# Altium schematic sheet Copy of KNX_Relay_16CH_V0.2.SchDoc
size 297 x 209 mm
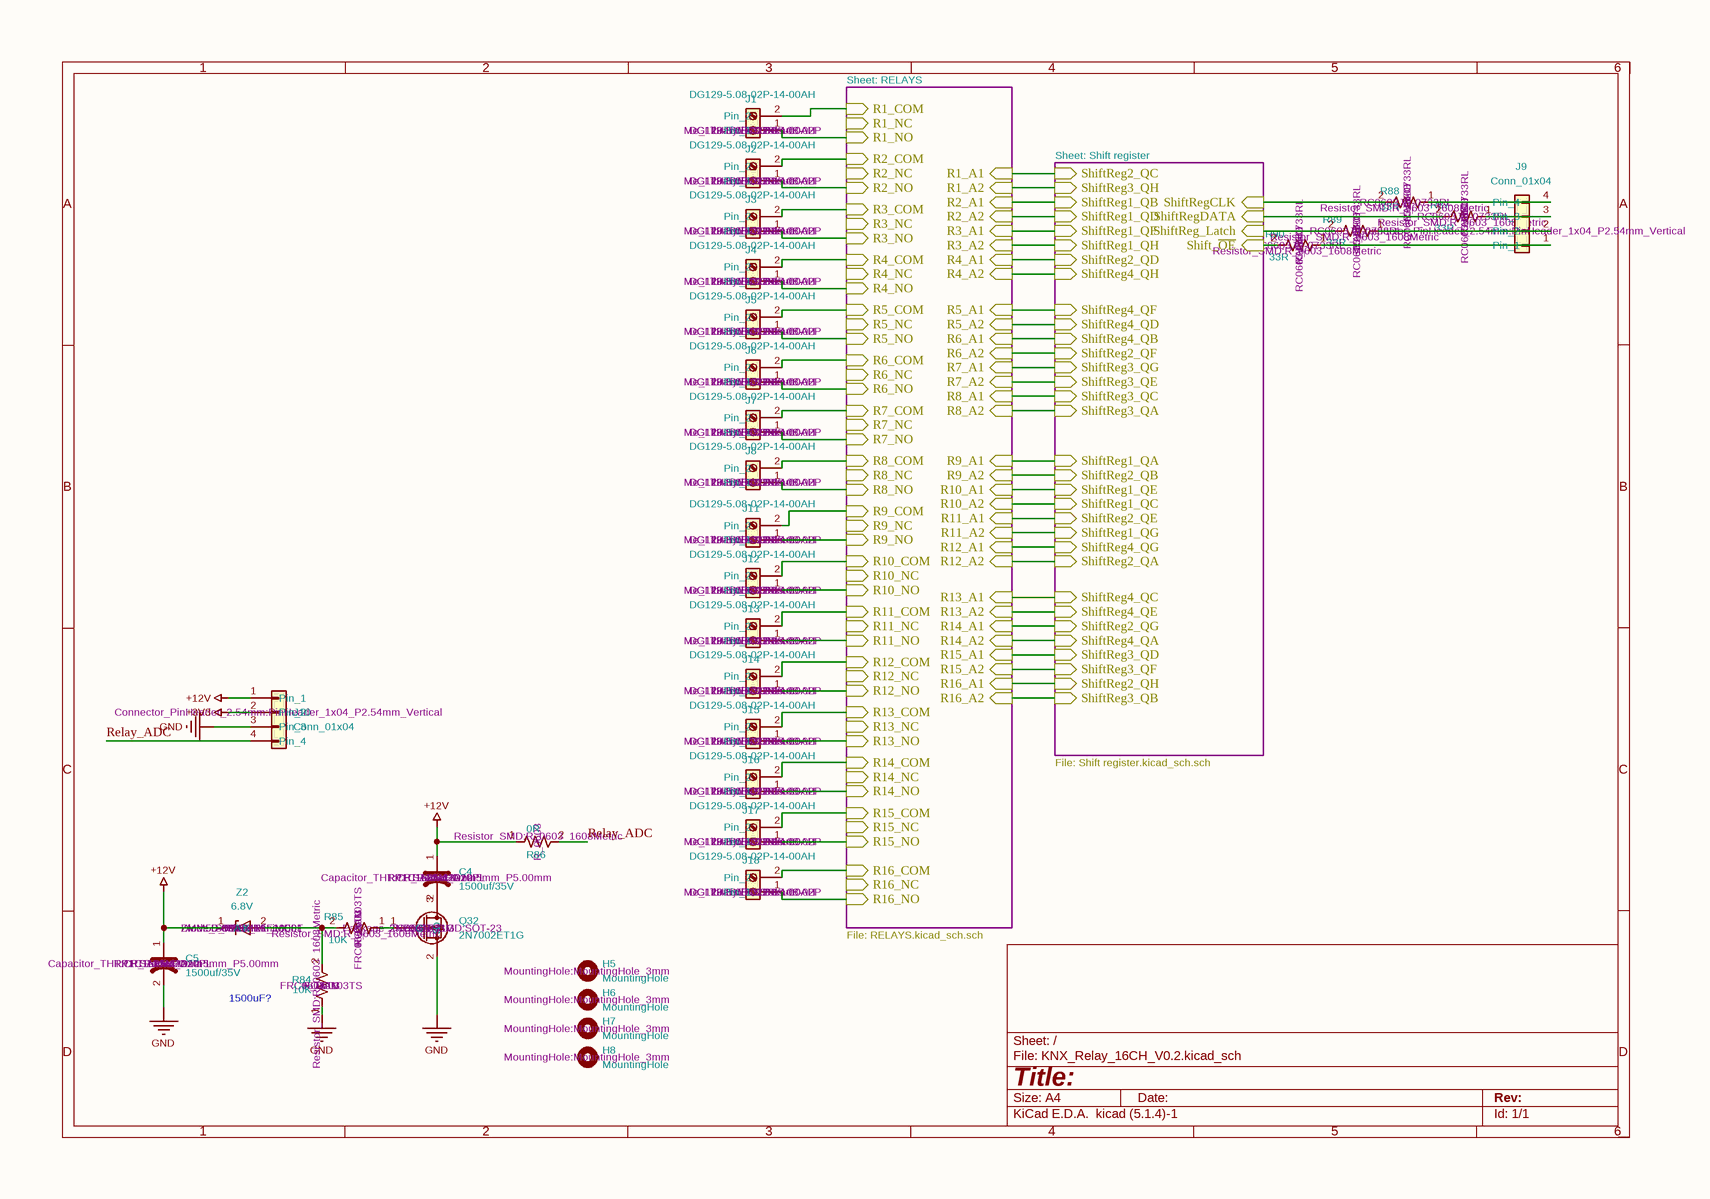
[diagram p0: Copy of KNX_Relay_16CH_V0.2.SchDoc]

## Parts
C4  MP: RP1C158M12020PL  MF: SAMWHA  Package: THT 12.5x20mm  Footprint: Capacitor_THT:CP_Radial_D12.5mm_P5.00mm  [CP_Radial_D12.5mm_P5.00mm]  (hidden comment: 1500uf/35V)
C5  MP: RP1C158M12020PL  MF: SAMWHA  Package: THT 12.5x20mm  Footprint: Capacitor_THT:CP_Radial_D12.5mm_P5.00mm  [CP_Radial_D12.5mm_P5.00mm]  (hidden comment: 1500uf/35V)
H5  Footprint: MountingHole:MountingHole_3mm  [MountingHole_3mm]  (hidden comment: MountingHole)
H6  Footprint: MountingHole:MountingHole_3mm  [MountingHole_3mm]  (hidden comment: MountingHole)
H7  Footprint: MountingHole:MountingHole_3mm  [MountingHole_3mm]  (hidden comment: MountingHole)
H8  Footprint: MountingHole:MountingHole_3mm  [MountingHole_3mm]  (hidden comment: MountingHole)
J1  MF: DEGSON  Package: THT V/T  5.08mm  Footprint: Me_Library:DG129-5.08-02P  [DG129-5.08-02P]  (hidden comment: DG129-5.08-02P-14-00AH)
J2  MF: DEGSON  Package: THT V/T  5.08mm  Footprint: Me_Library:DG129-5.08-02P  [DG129-5.08-02P]  (hidden comment: DG129-5.08-02P-14-00AH)
J3  MF: DEGSON  Package: THT V/T  5.08mm  Footprint: Me_Library:DG129-5.08-02P  [DG129-5.08-02P]  (hidden comment: DG129-5.08-02P-14-00AH)
J4  MF: DEGSON  Package: THT V/T  5.08mm  Footprint: Me_Library:DG129-5.08-02P  [DG129-5.08-02P]  (hidden comment: DG129-5.08-02P-14-00AH)
J5  MF: DEGSON  Package: THT V/T  5.08mm  Footprint: Me_Library:DG129-5.08-02P  [DG129-5.08-02P]  (hidden comment: DG129-5.08-02P-14-00AH)
J6  MF: DEGSON  Package: THT V/T  5.08mm  Footprint: Me_Library:DG129-5.08-02P  [DG129-5.08-02P]  (hidden comment: DG129-5.08-02P-14-00AH)
J7  MF: DEGSON  Package: THT V/T  5.08mm  Footprint: Me_Library:DG129-5.08-02P  [DG129-5.08-02P]  (hidden comment: DG129-5.08-02P-14-00AH)
J8  MF: DEGSON  Package: THT V/T  5.08mm  Footprint: Me_Library:DG129-5.08-02P  [DG129-5.08-02P]  (hidden comment: DG129-5.08-02P-14-00AH)
J9  Footprint: Connector_PinHeader_2.54mm:PinHeader_1x04_P2.54mm_Vertical  [PinHeader_1x04_P2.54mm_Vertical]  (hidden comment: Conn_01x04)
J10  Footprint: Connector_PinHeader_2.54mm:PinHeader_1x04_P2.54mm_Vertical  [PinHeader_1x04_P2.54mm_Vertical]  (hidden comment: Conn_01x04)
J11  MF: DEGSON  Package: THT V/T  5.08mm  Footprint: Me_Library:DG129-5.08-02P  [DG129-5.08-02P]  (hidden comment: DG129-5.08-02P-14-00AH)
J12  MF: DEGSON  Package: THT V/T  5.08mm  Footprint: Me_Library:DG129-5.08-02P  [DG129-5.08-02P]  (hidden comment: DG129-5.08-02P-14-00AH)
J13  MF: DEGSON  Package: THT V/T  5.08mm  Footprint: Me_Library:DG129-5.08-02P  [DG129-5.08-02P]  (hidden comment: DG129-5.08-02P-14-00AH)
J14  MF: DEGSON  Package: THT V/T  5.08mm  Footprint: Me_Library:DG129-5.08-02P  [DG129-5.08-02P]  (hidden comment: DG129-5.08-02P-14-00AH)
J15  MF: DEGSON  Package: THT V/T  5.08mm  Footprint: Me_Library:DG129-5.08-02P  [DG129-5.08-02P]  (hidden comment: DG129-5.08-02P-14-00AH)
J16  MF: DEGSON  Package: THT V/T  5.08mm  Footprint: Me_Library:DG129-5.08-02P  [DG129-5.08-02P]  (hidden comment: DG129-5.08-02P-14-00AH)
J17  MF: DEGSON  Package: THT V/T  5.08mm  Footprint: Me_Library:DG129-5.08-02P  [DG129-5.08-02P]  (hidden comment: DG129-5.08-02P-14-00AH)
J18  MF: DEGSON  Package: THT V/T  5.08mm  Footprint: Me_Library:DG129-5.08-02P  [DG129-5.08-02P]  (hidden comment: DG129-5.08-02P-14-00AH)
Q32  MF: onsemi  Footprint: Package_TO_SOT_SMD:SOT-23  [SOT-23]  (hidden comment: 2N7002ET1G)
R84  MP: FRC0603J103TS  MF: FOJAN  Package: R_0603  Footprint: Resistor_SMD:R_0603_1608Metric  [R_0603_1608Metric]  (hidden comment: 10K)
R85  MP: FRC0603J103TS  MF: FOJAN  Package: R_0603  Footprint: Resistor_SMD:R_0603_1608Metric  [R_0603_1608Metric]  (hidden comment: 10K)
R86  Package: R_0603  Footprint: Resistor_SMD:R_0603_1608Metric  [R_0603_1608Metric]  (hidden comment: 0R)
R87  MP: RC0603JR-0733RL  MF: YAGEO  Package: R_0603  Footprint: Resistor_SMD:R_0603_1608Metric  [R_0603_1608Metric]  (hidden comment: 33R)
R88  MP: RC0603JR-0733RL  MF: YAGEO  Package: R_0603  Footprint: Resistor_SMD:R_0603_1608Metric  [R_0603_1608Metric]  (hidden comment: 33R)
R89  MP: RC0603JR-0733RL  MF: YAGEO  Package: R_0603  Footprint: Resistor_SMD:R_0603_1608Metric  [R_0603_1608Metric]  (hidden comment: 33R)
R90  MP: RC0603JR-0733RL  MF: YAGEO  Package: R_0603  Footprint: Resistor_SMD:R_0603_1608Metric  [R_0603_1608Metric]  (hidden comment: 33R)
Z2  MF: PANJIT  MP: ZMM55-C6V8_R1_10001  Footprint: Diode_SMD:D_MiniMELF  [D_MiniMELF]  (hidden comment: 6.8V)

## Sub-sheets
RELAYS = RELAYS.SchDoc: R1_A1 (in), R1_A2 (in), R1_COM (in), R1_NC (in), R1_NO (in), R2_A1 (in), R2_A2 (in), R2_COM (in), R2_NC (in), R2_NO (in), R3_A1 (in), R3_A2 (in), R3_COM (in), R3_NC (in), R3_NO (in), R4_A1 (in), R4_A2 (in), R4_COM (in), R4_NC (in), R4_NO (in), R5_A1 (in), R5_A2 (in), R5_COM (in), R5_NC (in), R5_NO (in), R6_A1 (in), R6_A2 (in), R6_COM (in), R6_NC (in), R6_NO (in), R7_A1 (in), R7_A2 (in), R7_COM (in), R7_NC (in), R7_NO (in), R8_A1 (in), R8_A2 (in), R8_COM (in), R8_NC (in), R8_NO (in), R9_A1 (in), R9_A2 (in), R9_COM (in), R9_NC (in), R9_NO (in), R10_A1 (in), R10_A2 (in), R10_COM (in), R10_NC (in), R10_NO (in), R11_A1 (in), R11_A2 (in), R11_COM (in), R11_NC (in), R11_NO (in), R12_A1 (in), R12_A2 (in), R12_COM (in), R12_NC (in), R12_NO (in), R13_A1 (in), R13_A2 (in), R13_COM (in), R13_NC (in), R13_NO (in), R14_A1 (in), R14_A2 (in), R14_COM (in), R14_NC (in), R14_NO (in), R15_A1 (in), R15_A2 (in), R15_COM (in), R15_NC (in), R15_NO (in), R16_A1 (in), R16_A2 (in), R16_COM (in), R16_NC (in), R16_NO (in)
Shift register = Shift register.SchDoc: ShiftReg1_QA (in), ShiftReg1_QB (in), ShiftReg1_QC (in), ShiftReg1_QD (in), ShiftReg1_QE (in), ShiftReg1_QF (in), ShiftReg1_QG (in), ShiftReg1_QH (in), ShiftReg2_QA (in), ShiftReg2_QB (in), ShiftReg2_QC (in), ShiftReg2_QD (in), ShiftReg2_QE (in), ShiftReg2_QF (in), ShiftReg2_QG (in), ShiftReg2_QH (in), ShiftRegCLK (in), ShiftRegDATA (in), ShiftReg_Latch (in), Shift_~{OE} (in), ShiftReg3_QA (in), ShiftReg3_QB (in), ShiftReg3_QC (in), ShiftReg3_QD (in), ShiftReg3_QE (in), ShiftReg3_QF (in), ShiftReg3_QG (in), ShiftReg3_QH (in), ShiftReg4_QA (in), ShiftReg4_QB (in), ShiftReg4_QC (in), ShiftReg4_QD (in), ShiftReg4_QE (in), ShiftReg4_QF (in), ShiftReg4_QG (in), ShiftReg4_QH (in)

## Nets
+3V3: J10.2(Pin_2)
+12V: C4.1 C5.1 J10.1(Pin_1) R86.1 Z2.1(K)
GND: C5.2 J10.3(Pin_3) Q32.2(S) R84.1
Relay_ADC: J10.4(Pin_4) R86.2
NetC4_2: C4.2 Q32.3(D)
NetJ1_1: J1.1(Pin_1) ; sheet RELAYS/R1_NO
NetJ1_2: J1.2(Pin_2) ; sheet RELAYS/R1_COM
NetJ2_1: J2.1(Pin_1) ; sheet RELAYS/R2_NO
NetJ2_2: J2.2(Pin_2) ; sheet RELAYS/R2_COM
NetJ3_1: J3.1(Pin_1) ; sheet RELAYS/R3_NO
NetJ3_2: J3.2(Pin_2) ; sheet RELAYS/R3_COM
NetJ4_1: J4.1(Pin_1) ; sheet RELAYS/R4_NO
NetJ4_2: J4.2(Pin_2) ; sheet RELAYS/R4_COM
NetJ5_1: J5.1(Pin_1) ; sheet RELAYS/R5_NO
NetJ5_2: J5.2(Pin_2) ; sheet RELAYS/R5_COM
NetJ6_1: J6.1(Pin_1) ; sheet RELAYS/R6_NO
NetJ6_2: J6.2(Pin_2) ; sheet RELAYS/R6_COM
NetJ7_1: J7.1(Pin_1) ; sheet RELAYS/R7_NO
NetJ7_2: J7.2(Pin_2) ; sheet RELAYS/R7_COM
NetJ8_1: J8.1(Pin_1) ; sheet RELAYS/R8_NO
NetJ8_2: J8.2(Pin_2) ; sheet RELAYS/R8_COM
NetJ9_1: J9.1(Pin_1) R90.1
NetJ9_2: J9.2(Pin_2) R89.1
NetJ9_3: J9.3(Pin_3) R87.1
NetJ9_4: J9.4(Pin_4) R88.1
NetJ11_1: J11.1(Pin_1) ; sheet RELAYS/R9_NO
NetJ11_2: J11.2(Pin_2) ; sheet RELAYS/R9_COM
NetJ12_1: J12.1(Pin_1) ; sheet RELAYS/R10_NO
NetJ12_2: J12.2(Pin_2) ; sheet RELAYS/R10_COM
NetJ13_1: J13.1(Pin_1) ; sheet RELAYS/R11_NO
NetJ13_2: J13.2(Pin_2) ; sheet RELAYS/R11_COM
NetJ14_1: J14.1(Pin_1) ; sheet RELAYS/R12_NO
NetJ14_2: J14.2(Pin_2) ; sheet RELAYS/R12_COM
NetJ15_1: J15.1(Pin_1) ; sheet RELAYS/R13_NO
NetJ15_2: J15.2(Pin_2) ; sheet RELAYS/R13_COM
NetJ16_1: J16.1(Pin_1) ; sheet RELAYS/R14_NO
NetJ16_2: J16.2(Pin_2) ; sheet RELAYS/R14_COM
NetJ17_1: J17.1(Pin_1) ; sheet RELAYS/R15_NO
NetJ17_2: J17.2(Pin_2) ; sheet RELAYS/R15_COM
NetJ18_1: J18.1(Pin_1) ; sheet RELAYS/R16_NO
NetJ18_2: J18.2(Pin_2) ; sheet RELAYS/R16_COM
NetQ32_1: Q32.1(G) R85.1
NetR84_2: R84.2 R85.2 Z2.2(A)
NetR87_2: R87.2 ; sheet Shift register/ShiftRegDATA
NetR88_2: R88.2 ; sheet Shift register/ShiftRegCLK
NetR89_2: R89.2 ; sheet Shift register/ShiftReg_Latch
NetR90_2: R90.2 ; sheet Shift register/Shift_~{OE}
(unnamed): sheet RELAYS/R1_A1, sheet Shift register/ShiftReg2_QC
(unnamed): sheet RELAYS/R1_A2, sheet Shift register/ShiftReg3_QH
(unnamed): sheet RELAYS/R2_A1, sheet Shift register/ShiftReg1_QB
(unnamed): sheet RELAYS/R2_A2, sheet Shift register/ShiftReg1_QD
(unnamed): sheet RELAYS/R3_A1, sheet Shift register/ShiftReg1_QF
(unnamed): sheet RELAYS/R3_A2, sheet Shift register/ShiftReg1_QH
(unnamed): sheet RELAYS/R4_A1, sheet Shift register/ShiftReg2_QD
(unnamed): sheet RELAYS/R4_A2, sheet Shift register/ShiftReg4_QH
(unnamed): sheet RELAYS/R5_A1, sheet Shift register/ShiftReg4_QF
(unnamed): sheet RELAYS/R5_A2, sheet Shift register/ShiftReg4_QD
(unnamed): sheet RELAYS/R6_A1, sheet Shift register/ShiftReg4_QB
(unnamed): sheet RELAYS/R6_A2, sheet Shift register/ShiftReg2_QF
(unnamed): sheet RELAYS/R7_A1, sheet Shift register/ShiftReg3_QG
(unnamed): sheet RELAYS/R7_A2, sheet Shift register/ShiftReg3_QE
(unnamed): sheet RELAYS/R8_A1, sheet Shift register/ShiftReg3_QC
(unnamed): sheet RELAYS/R8_A2, sheet Shift register/ShiftReg3_QA
(unnamed): sheet RELAYS/R9_A1, sheet Shift register/ShiftReg1_QA
(unnamed): sheet RELAYS/R9_A2, sheet Shift register/ShiftReg2_QB
(unnamed): sheet RELAYS/R10_A1, sheet Shift register/ShiftReg1_QE
(unnamed): sheet RELAYS/R10_A2, sheet Shift register/ShiftReg1_QC
(unnamed): sheet RELAYS/R11_A1, sheet Shift register/ShiftReg2_QE
(unnamed): sheet RELAYS/R11_A2, sheet Shift register/ShiftReg1_QG
(unnamed): sheet RELAYS/R12_A1, sheet Shift register/ShiftReg4_QG
(unnamed): sheet RELAYS/R12_A2, sheet Shift register/ShiftReg2_QA
(unnamed): sheet RELAYS/R13_A1, sheet Shift register/ShiftReg4_QC
(unnamed): sheet RELAYS/R13_A2, sheet Shift register/ShiftReg4_QE
(unnamed): sheet RELAYS/R14_A1, sheet Shift register/ShiftReg2_QG
(unnamed): sheet RELAYS/R14_A2, sheet Shift register/ShiftReg4_QA
(unnamed): sheet RELAYS/R15_A1, sheet Shift register/ShiftReg3_QD
(unnamed): sheet RELAYS/R15_A2, sheet Shift register/ShiftReg3_QF
(unnamed): sheet RELAYS/R16_A1, sheet Shift register/ShiftReg2_QH
(unnamed): sheet RELAYS/R16_A2, sheet Shift register/ShiftReg3_QB

## Notes on the sheet
- Sheet: RELAYS
- Sheet: Shift register
- File: Shift register.kicad_sch.sch
- File: RELAYS.kicad_sch.sch
- 1500uF?
- 1
- 2
- 3
- 4
- 5
- 6
- A
- B
- C
- D
- Title:
- File: KNX_Relay_16CH_V0.2.kicad_sch
- Sheet: /
- KiCad E.D.A.  kicad (5.1.4)-1
- Size: A4
- Date:
- Rev:
- Id: 1/1

## Library data of the parts
C4 C5 = C_US: OZD: RP1C158M12020PL; Value: 1500uf/35V
J1-J8 J11-J18 = Screw_Terminal_01x02: MP: DG129-5.08-02P-14-00AH; OZD: DG129-5.08-02P-14-00AH; Value: DG129-5.08-02P-14-00AH
Q32 = Q_NMOS_Depletion_GSD: MP: 2N7002ET1G; Package: SOT-23; OZD: 2N7002ET1G; Value: 2N7002ET1G
R84-R90 = R_US
  R84 R85: Value: 10K
  R86: Value: 0R
  R87-R90: OZD: RC0603JR-0733RL; Value: 33R
Z2 = D_Zener: OZD: ZMM55-C6V8_R1_10001; Package: D_MiniMELF; Value: 6.8V
H5-H8 = MountingHole: Value: MountingHole
J9 J10 = Conn_01x04: Value: Conn_01x04